# Altium schematic sheet Ultrasonic_Transducer.SchDoc: Tranducers
size A3; DrawnBy: Jonathan Edwards; Organization: ECE Department; Address1: University of Canterbury; Address2: Christchurch 8041; Address3: New Zealand; Revision: A; SheetNumber: 2; SheetTotal: 2; JobNumber: ENEL PROD
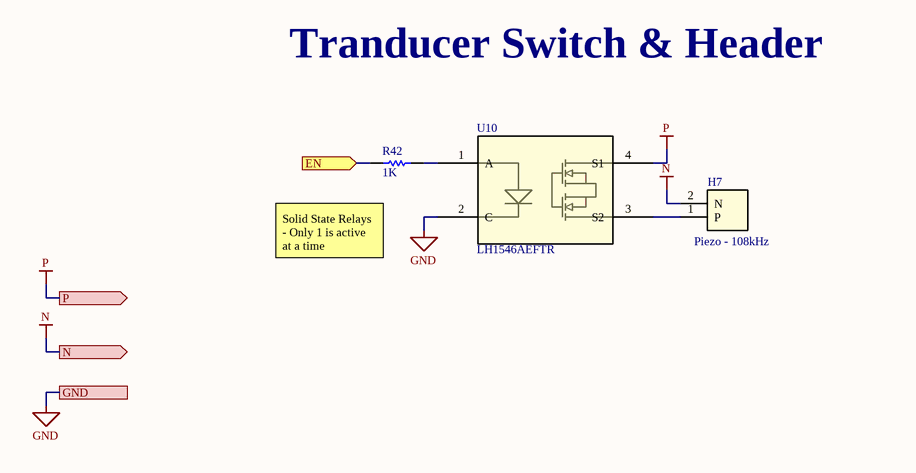
[diagram p0: Ultrasonic_Transducer.SchDoc]

## Parts
H7  Piezo - 108kHz  [JST_B2B-PH-K-S]
R42  1K  [R_0603]
U10  LH1546AEFTR  [SO_6AEFTR_VIS-M]

## Ports
EN (in), GND, N (out), P (out)

## Nets
GND: U10.2(C) ; port GND
N: H7.2(N) ; port N
P: U10.4(S1) ; port P
EN: R42.1 ; port EN
NetH7_1: H7.1(P) U10.3(S2)
NetR42_2: R42.2 U10.1(A)

## Notes on the sheet
- Tranducer Switch & Header
- (near R42) Solid State Relays - Only 1 is active at a time
- Title
- Drawn by:
- Date:
- Time:
- Revision:
- Job No:
- Sheet
- of
- File Name:

## Library data of the parts
H7 = 2 Pin Male 2mm: CONN HDR 2POS 0.1 TIN PCB; Website - output: https://www.aliexpress.com/item/1005006477559838.html
R42 = RS_1K: RES 1K OHM 1% 1/10W 0603; Cost: 0.16; Website: https://www.digikey.co.nz/product-detail/en/yageo/RC0603FR-071KL/311-1-00KHRCT-ND/729790; Supplier Part Number 1: 311-1.00KHRCT-ND; Supplier 1: Digi-Key; Value: 1K
U10 = LH1546AEFTR: Solid State SPST-NO (1 Form A) 4-SOP (0.173", 4.40mm); Mfr_Name: Vishay; Copyright: Copyright (C) 2024 Ultra Librarian. All rights reserved.; Manufacturer_Part_Number: LH1546AEFTR; RefDes: RefDes; Type: DEV